# Altium schematic sheet POWER.SchDoc
size A4
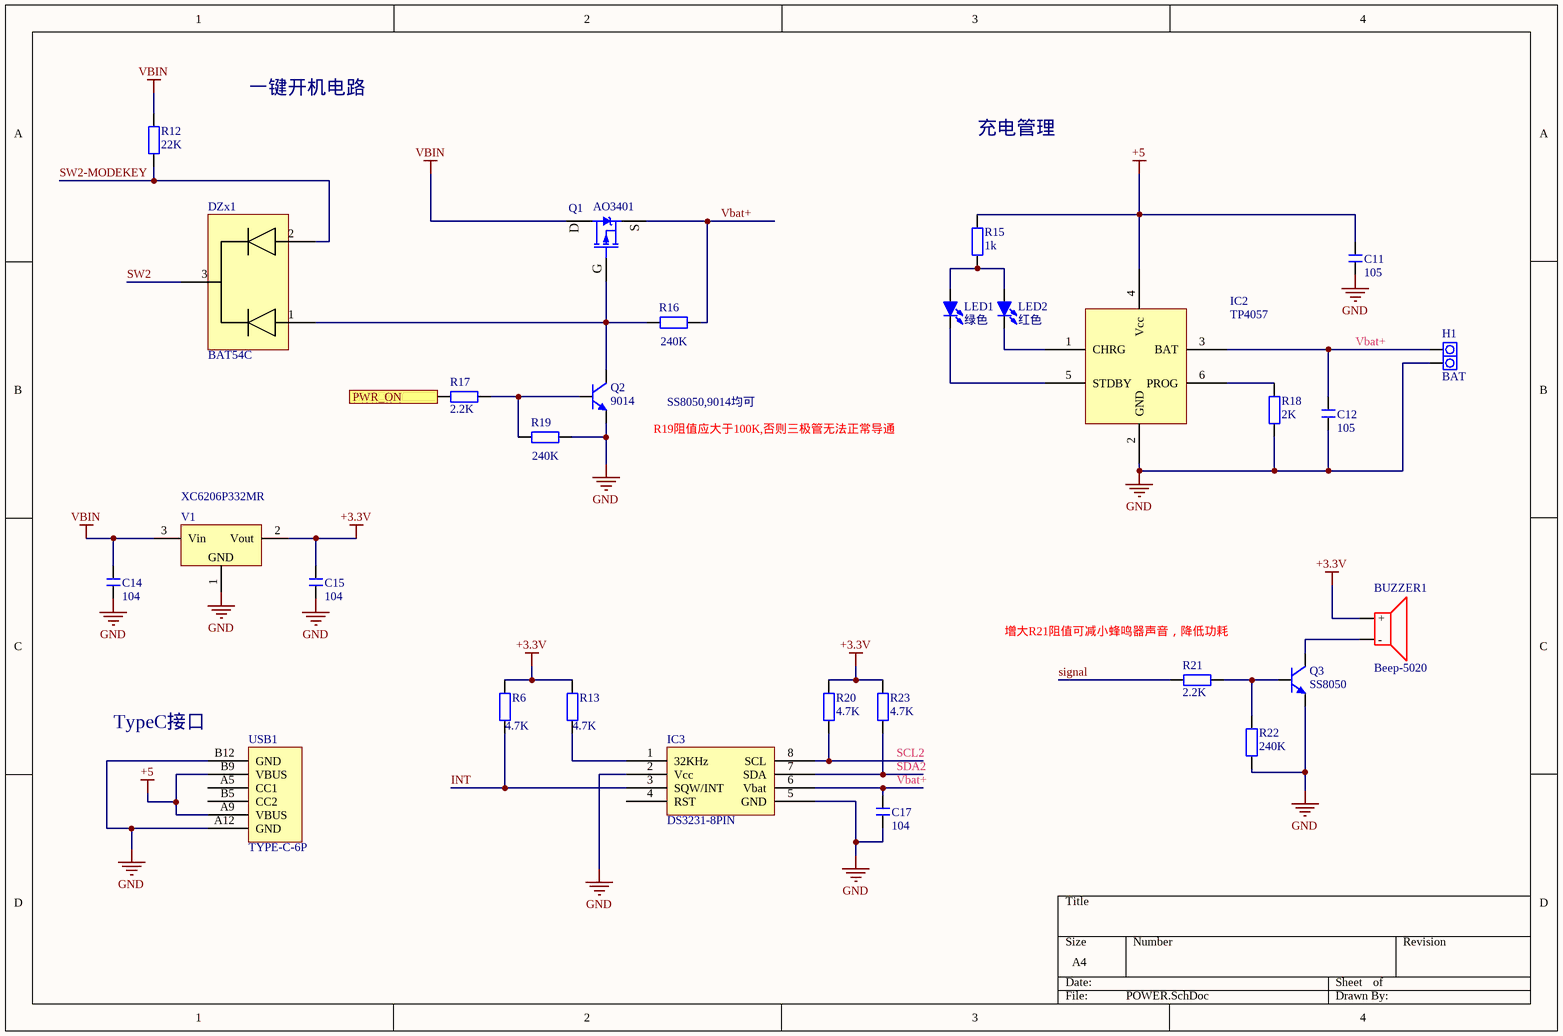
[diagram p0: POWER.SchDoc]

## Parts
BUZZER1  Beep-5020  [5020BUZZER]
C11  105  [C0603]
C12  105  [C0603]
C14  104  [C0805]
C15  104  [C0805]
C17  104  [C0805]
DZx1  BAT54C  [SOT23-3N]
H1  BAT  [PAD2-2.54]
IC2  TP4057  [SOT23-6N]
IC3  DS3231-8PIN  [SOP8_N]
LED1  绿色  [D0603G]
LED2  红色  [D0603R]
Q1  AO3401  [SOT23-3N]
Q2  9014  [SOT23-3N]
Q3  SS8050  [SOT23-3N]
R6  4.7K  [R0805]
R12  22K  [R0603]
R13  4.7K  [R0805]
R15  1k  [R0603]
R16  240K  [R0603]
R17  2.2K  [R0603]
R18  2K  [R0603]
R19  240K  [R0603]
R20  4.7K  [R0805]
R21  2.2K  [R0603]
R22  240K  [R0603]
R23  4.7K  [R0805]
USB1  TYPE-C-6P  [TYPE-6P-沉板]
V1  XC6206P332MR  [SOT23-3N]

## Ports
PWR_ON

## Nets
+3.3V: BUZZER1.1(+) C15.2 R6.2 R13.2 R20.2 R23.2 V1.2(Vout)
+5: C11.2 IC2.4(Vcc) R15.2 USB1.A9(VBUS) USB1.B9(VBUS)
GND: C11.1 C12.1 C14.1 C15.1 C17.1 H1.2 IC2.2(GND) IC3.2(Vcc) IC3.5(GND) Q2.2(E) Q3.2(E) R18.1 R19.2 R22.1 USB1.A12(GND) USB1.B12(GND) V1.1(GND)
VBIN: C14.2 Q1.3(D) R12.2 V1.3(Vin)
INT: IC3.3(SQW/INT) R6.1
PWR_ON: R17.1 ; port PWR_ON
SCL2: IC3.8(SCL) R20.1
SDA2: IC3.7(SDA) R23.1
signal: R21.1
SW2: DZx1.3
SW2-MODEKEY: DZx1.2 R12.1
Vbat+: C12.2 C17.2 H1.1 IC2.3(BAT) IC3.6(Vbat) Q1.2(S) R16.2
NetBUZZER1_2: BUZZER1.2(-) Q3.3(C)
NetDZx1_1: DZx1.1 Q1.1(G) Q2.3(C) R16.1
NetIC2_1: IC2.1(CHRG) LED2.2(K)
NetIC2_5: IC2.5(STDBY) LED1.2(K)
NetIC2_6: IC2.6(PROG) R18.2
NetIC3_1: IC3.1(32KHz) R13.1
NetLED1_1: LED1.1(A) LED2.1(A) R15.1
NetQ2_1: Q2.1(B) R17.2 R19.1
NetQ3_1: Q3.1(B) R21.2 R22.2

Not connected (* = marked no-connect by the designer): IC3 4(RST); USB1 A5(CC1) B5(CC2)

## Notes on the sheet
- 一键开机电路
- 充电管理
- (near Q2) R19阻值应大于100K,否则三极管无法正常导通
- SS8050,9014均可
- 增大R21阻值可减小蜂鸣器声音，降低功耗
- TypeC接口

## Library data of the parts
BUZZER1 = Beep-5020: 贴片蜂鸣器5020最小封装
C11 C12 C17 = C: 无极性贴片电容; 版权归属: 源创客; BOM名称: 无极性贴片电容; 学习资源: www.ooocke.com
C14 C15 = C: 无极性贴片电容; 版权归属: 源创客; 材质: X7R; BOM名称: 无极性贴片电容; 学习资源: www.ooocke.com
DZx1 = BAT54C: 双肖特基，共阴极
H1 = PAD2: 引线焊盘; 版权归属: 源创客; BOM名称: 引线焊盘; 学习资源: www.ooocke.com
IC2 = TP4057/4059: 500mA/600mA锂电池充电管理IC
LED1 LED2 = LED-SMD: 贴片LED; 版权归属: 源创客; BOM名称: 贴片LED; 学习资源: www.ooocke.com
Q1 = SI2301: P沟道场效应管; 版权归属: 源创客; BOM名称: P沟道场效应管; 学习资源: www.ooocke.com
Q2 = 9014-SMD: 低噪放大-NPN型; 版权归属: 源创客; 属性: 50V 0.1A 0.4W 150MHZ; BOM名称: 低噪放大-NPN型; 学习资源: www.ooocke.com
Q3 = 8050-SMD: 高频放大-NPN型; 版权归属: 源创客; 属性: 40V 1.5A 1W 100MHZ; BOM名称: 高频放大-NPN型; 学习资源: www.ooocke.com
R6 R12 R13 R15-R23 = R: 贴片电阻; 版权归属: 源创客; BOM名称: 贴片电阻; 学习资源: www.ooocke.com
USB1 = TYPE-C-6P: type-c-6p-沉板; BOM名称: USB-C型母接口; 版权归属: 源创客; 学习资源: www.ooocke.com
V1 = XC6206P332MR: 低压差线性稳压芯片; 版权归属: 源创客; BOM名称: 低压差线性稳压芯片; 学习资源: www.ooocke.com